# EAGLE design LB_p1_Power-v03(rev2) (EAGLE 6.6.0)
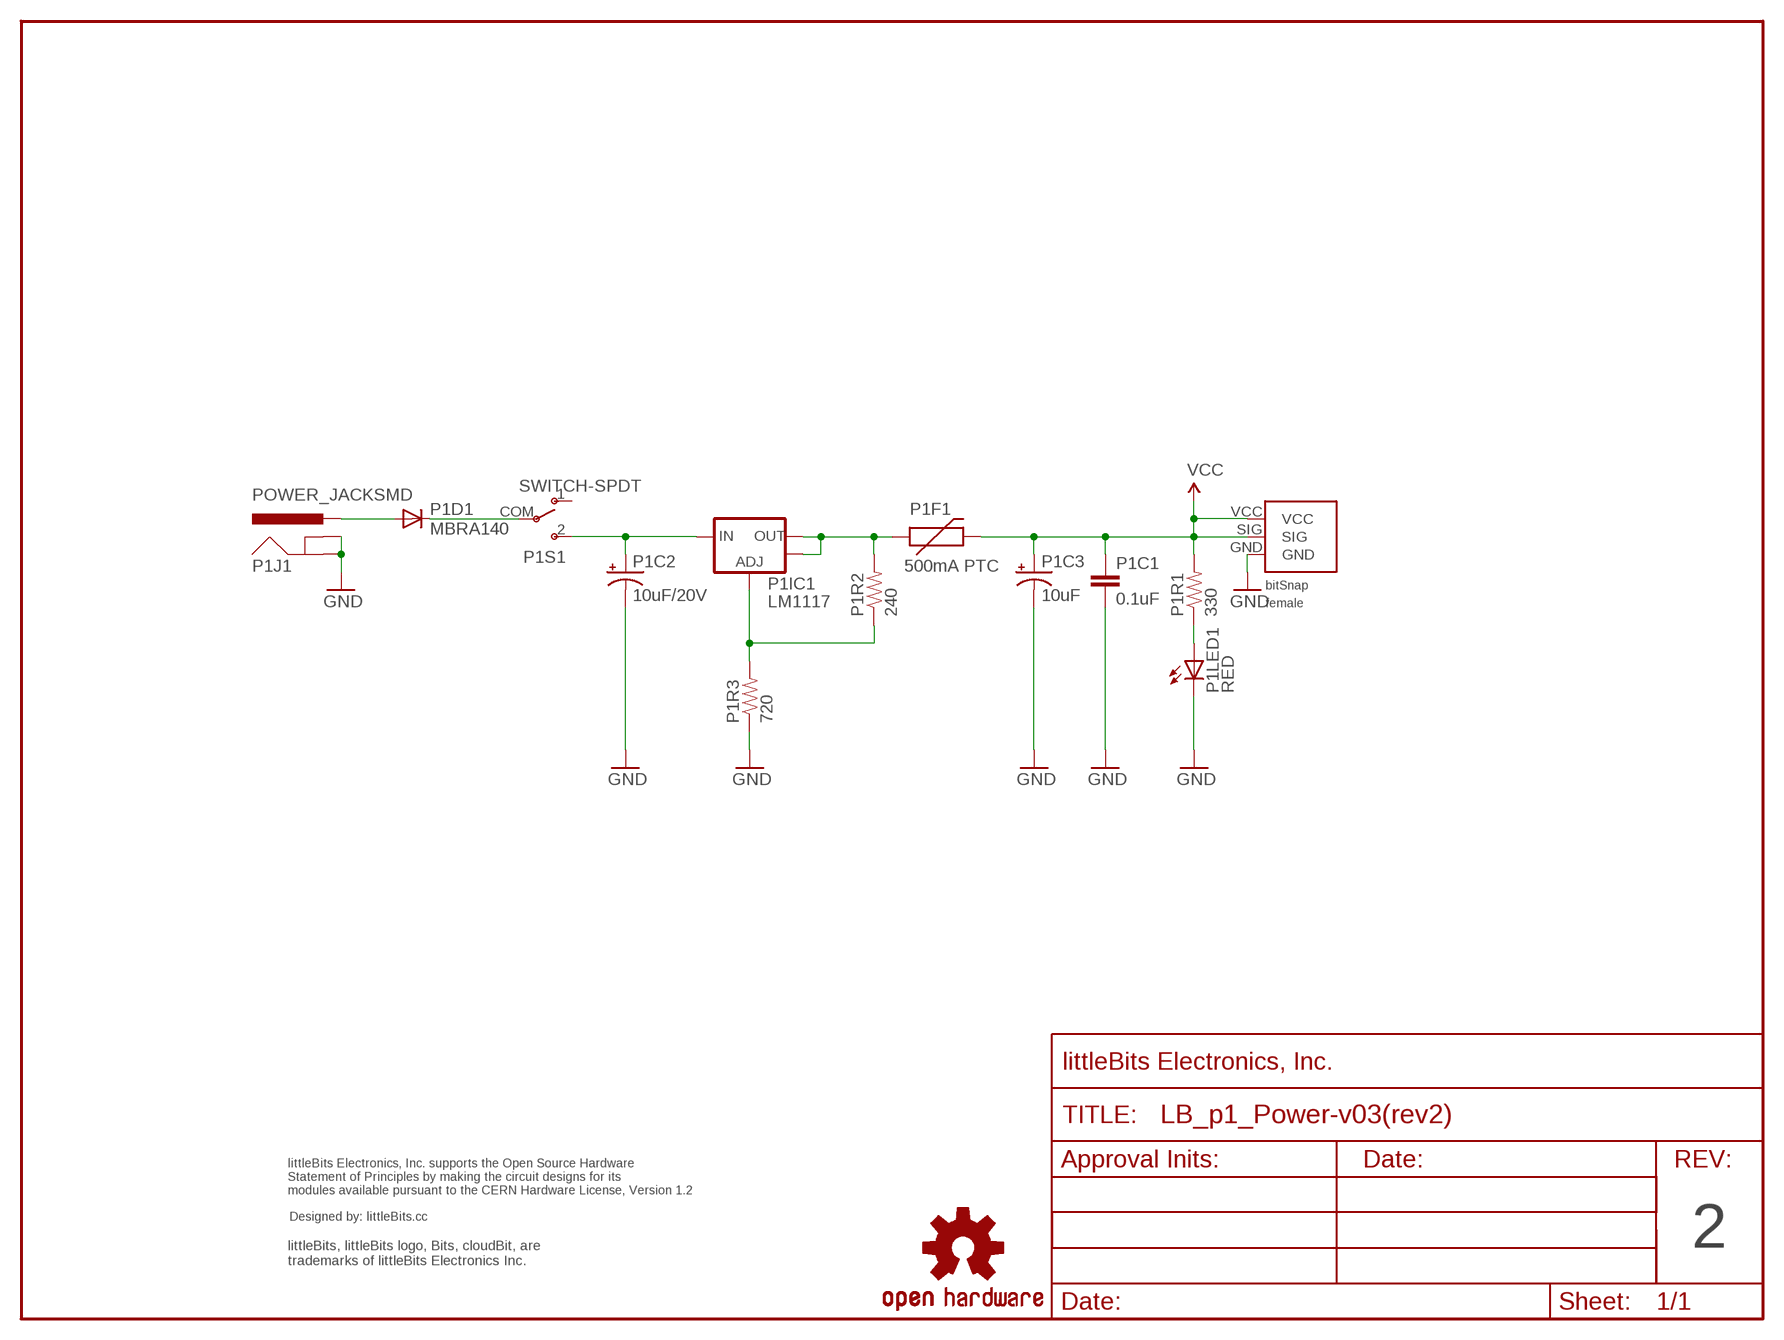
[diagram p0: schematic, sheet 1]

## Parts
P1BSF1  BITSNAP_V03_FEMALE  [BITSNAP_V03_FEMALE]
P1C1  0.1uF  CAP0603-CAP  [0603-CAP]
P1C2  10uF/20V  CAP_POL3528  [EIA3528]
P1C3  10uF  CAP_POL1206  [EIA3216]
P1D1  MBRA140  DIODESMA  [SMA-DIODE]
P1F1  500mA PTC  PTCSMD  [PTC-1206]
P1IC1  LM1117  V_REG_LM1117SOT223  [SOT223]
P1J1  POWER_JACKSMD  [POWER_JACK_SMD]
P1LED1  RED  LED1206  [LED-1206]
P1R1  330  RESISTOR0603-RES  [0603-RES]
P1R2  240  RESISTOR0603-RES  [0603-RES]
P1R3  720  RESISTOR0603-RES  [0603-RES]
P1S1  SWITCH-SPDT  SWITCH-DICGU_SPDT  [LITTLEBITS_SWITCH-DICGU_SPDT]
U$3  OSHW-LOGOL  [OSHW-LOGO-L]
U$4  LB_CREDITS  [OSHWCREDIT]
U$5  FRAME-LETTER-OHWOHW  [FABDWG01-OHW]

## Nets
GND: P1BSF1.GND P1C1.2 P1C2.C(-) P1C3.C(-) P1J1.GND(GNDBREAK) P1J1.P$4(GND) P1LED1.C P1R3.1
N$1: P1D1.C P1S1.COM(P)
N$2: P1F1.1 P1IC1.2(OUT) P1IC1.4(OUT) P1R2.2
N$3: P1IC1.1(ADJ) P1R2.1 P1R3.2
N$4: P1C2.A(+) P1IC1.3(IN) P1S1.2(S)
N$6: P1D1.A P1J1.VIN0(PWR)
N$8: P1LED1.A P1R1.1
VCC: P1BSF1.SIG P1BSF1.VCC P1C1.1 P1C3.A(+) P1F1.2 P1R1.2
Unconnected: P1S1.1(O)

## Notes on the sheet
- 2

## Library data of the parts
P1BSF1 = bitSnap:BITSNAP_V03_FEMALE
P1C1 = SparkFun:CAP: Capacitor Standard 0603 ceramic capacitor, and 0.1" leaded capacitor.
P1C2 P1C3 = SparkFun:CAP_POL: Capacitor Polarized These are standard SMD and PTH capacitors. Normally 10uF, 47uF, and 100uF in electrolytic and tantalum varieties. Always verify the external diameter of the through hole cap, it varies with capacity, voltage, and manufacturer. The EIA devices should be standard.
P1D1 = SparkFun:DIODE: Diode These are standard reverse protection diodes and small signal diodes. SMA package can handle up to about 1A. SOD-323 can handle about 200mA. What the SOD-323 package when ordering, there are some mfgs out there that are 5-pin packages.
P1F1 = SparkFun:PTC: Resettable Fuse PTC Resettable Fuse. Spark Fun Electronics SKU : COM-08357
P1IC1 = SparkFun:V_REG_LM1117: Voltage Regulator LM1117 Standard adjustable voltage regulator but in SMD form. Spark Fun Electronics SKU : COM-00595
P1J1 = SparkFun:POWER_JACK: Power Jack This is the standard 5.5mm barrel jack for power. The PTH is the most common, proven, reliable, footprint. All others are experimental. The Slot footprint only works if the mill layer is transmitted to the PCB fab house so be warned. Spark Fun Electronics SKU : PRT-00119. Mating wall wart : TOL-00298 (and others)
P1LED1 = SparkFun:LED: LEDs Standard schematic elements and footprints for 5mm, 3mm, 1206, and 0603 sized LEDs. 5mm - Spark Fun Electronics SKU : COM-00529 (and others)
P1R1-P1R3 = SparkFun:RESISTOR: Resistor Basic schematic elements and footprints for 0603, 1206, and PTH 1/10th watt (small) resistors.
P1S1 = LITTLEBITS:SWITCH-DICGU_SPDT
U$3 = SparkFun:OSHW-LOGO: Open Source Hardware Logo This logo indicates the piece of hardware it is found on incorporates a OSHW license and/or adheres to the definition of open source hardware found here: http://freedomdefined.org/OSHW
U$4 = LITTLEBITS:LB_CREDITS
U$5 = LITTLEBITS:FRAME-LETTER-OHW

## Board
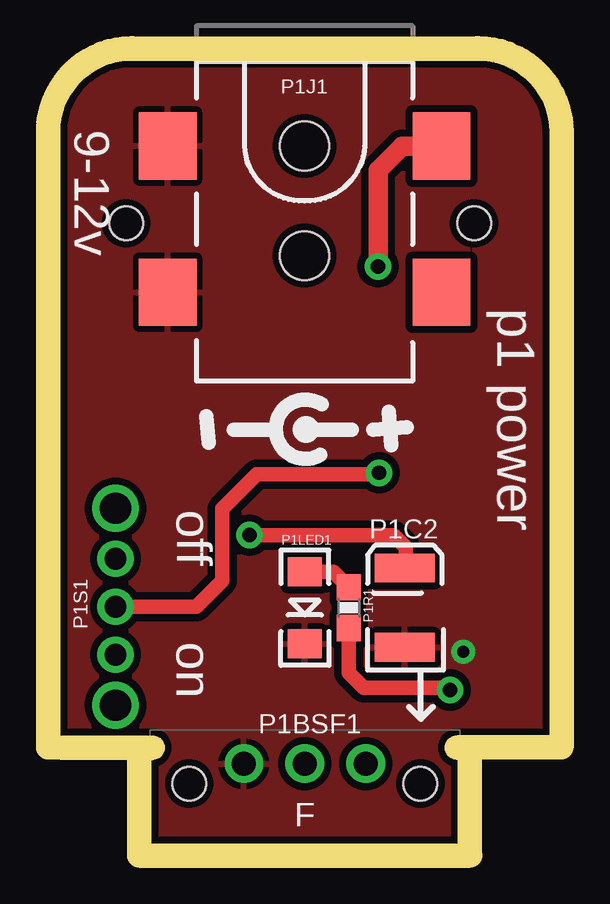
[diagram p1: board, top side]
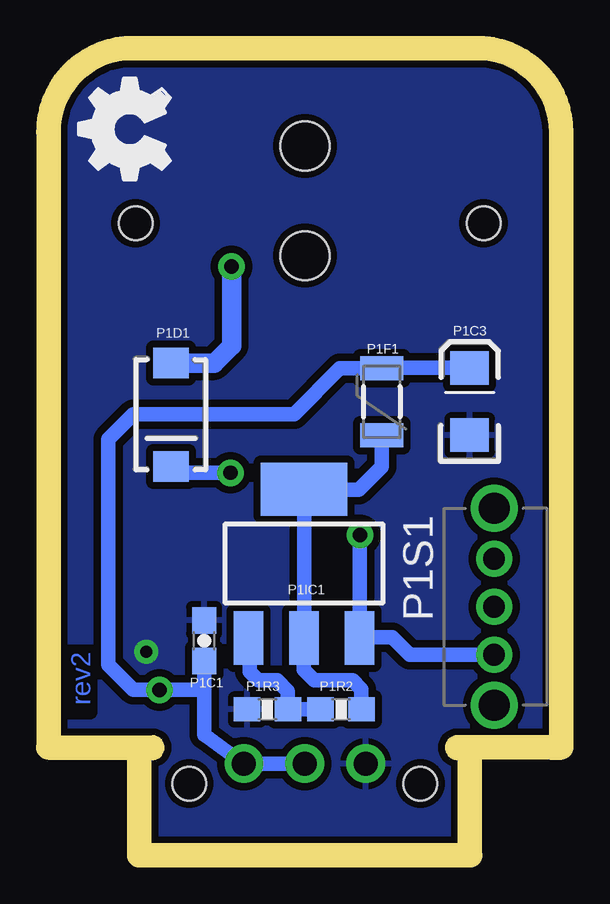
[diagram p2: board, bottom side, seen from below]

Size 20.4 x 32.65 mm. Coordinates in mm from the lower left corner, seen from the top.
Outline: 0,4.5 0,29.65
Outline: 0,29.65 0,29.71
Outline: 20.4,4.5 20.4,29.65 arc90 17.4,32.65 3,32.65 arc90 0,29.65
Copper layers (1*16): Top 0.035mm / dielectric 1.5mm / Bottom 0.035mm
Design rules "default": minimum track width 8mil, minimum drill 20mil, track to track 8mil, track to pad 8mil, pad to pad 8mil, via to via 8mil, smd to smd 8mil, copper to edge 10mil, drill to drill 8mil, minimum pad ring 12mil, minimum via ring 10mil, stop-mask expansion 4mil, vias tented up to drill 25mil, thermal gap 10mil
Milling: 7 lines

### Footprints (pad centres in the part's own frame; a part is rotated, then mirrored left to right if it is on the bottom)
BITSNAP_V03_FEMALE = drill 1: GND 3.91,3.33; SIG 6.45,3.33; VCC 8.99,3.33 | hole 1.4: 1.63,2.5; 11.27,2.5
0603-CAP = smd 1.1 x 1: 1 -0.85,0; 2 0.85,0
EIA3528 = smd 1.2 x 2.5: A 1.65,0; C -1.65,0
EIA3216 = smd 1.4 x 1.6: A 1.4,0; C -1.4,0
SMA-DIODE = smd 1.27 x 1.47: A -2.15,0; C 2.15,0
PTC-1206 = smd 1 x 1.8: 1 -1.4,0; 2 1.4,0
SOT223 = smd 1.219 x 2.235: 1 -2.311,-3.099; 2 0,-3.099; 3 2.311,-3.099 | smd 3.6 x 2.2: 4 0,3.099
POWER_JACK_SMD = smd 2.8 x 2.4: GND 0,-5.7; P$4 6.1,-5.7; VIN0 0,5.7; VIN1 6.1,5.7 | hole 2.032: 0,0; 4.572,0
LED-1206 = smd 1.2 x 1.4: A -1.5,0; C 1.5,0
0603-RES = smd 1.1 x 1: 1 -0.85,0; 2 0.85,0
LITTLEBITS_SWITCH-DICGU_SPDT = drill 0.9: 1 -2,0; 2 2,0; COM 0,0 | drill 1.3: P$4 4.1,0; P$5 -4.1,0
LB_PWR_LEGS = hole 1.4: 2.75,4.4; 17.25,4.4

### Placement (x,y rotation side)
P1BSF1  3.75,0 0 top
P1C1  14.39,8.45 90 bottom
P1C2  14.37,9.83 90 top
P1C3  3.33,18.42 90 bottom
P1D1  15.78,17.87 270 bottom
P1F1  6.99,18.41 90 bottom
P1IC1  10.23,11.67 0 bottom
P1J1  10.19,29.07 270 top
P1LED1  10.2,9.83 270 top
P1R1  12.03,9.83 270 top
P1R2  8.69,5.59 0 bottom
P1R3  11.75,5.59 0 bottom
P1S1  2.31,9.87 270 bottom
U$1  [+/-PWR_JACK]  10.2,15.05 0 top
U$2  [OSHW_FILLX150_NOTEXT]  15.81,26.82 0 top
U$3  -32.77,-67.74 0 top  (outside the outline)
U$4  -93.73,-62.43 0 top  (outside the outline)
U$5  0.2,0.1 0 top
U$12  [LB_PWR_LEGS]  0,21.45 0 top

### Tracks (layer width: path | path; a pad name or v marks a point on that pad's centre or on a via)
GND  (via drill 0.5)
  other vias: 16.8,8
  pour Top (isolate 0.305): 0.15,32.48 20.23,32.48 20.23,0.1 0.15,0.1
  pour Bottom (isolate 0.305): 0.15,32.48 20.23,32.48 20.23,0.1 0.15,0.1
N$1  (via drill 0.6)
  Top 0.61: P1S1.COM 5.67,9.87 6.75,10.95 6.75,13.95 8.2,15.4 13.25,15.4 v13.3,15.45
  Bottom 0.61: v13.3,15.45 15.7,15.45 15.8,15.84 P1D1.C
N$2
  Bottom 0.61: P1R2.2 7.84,6.44 8.2,6.8 9.8,6.8 10.25,7.25 10.25,8.55 P1IC1.2 P1IC1.4 10.21,14.75 7.95,14.75 6.99,15.71 P1F1.1
N$3
  Bottom 0.61: P1R2.1 P1R3.2 10.91,6.36 11.35,6.8 12.15,6.8 12.5,7.15 12.5,8.53 P1IC1.1
N$4  (via drill 0.6)
  Top 0.61: 14.3,11.3 P1C2.A 14.4,11.51 14.4,12.35 13.9,12.85 v7.9,12.85
  Bottom 0.61: P1S1.2 5.82,7.87 6.55,8.6 7.89,8.6 P1IC1.3 7.92,12.17 v7.9,12.85
N$6  (via drill 0.6)
  Top 0.813: v13.25,24.05 13.25,28.05 14.25,29.05 15.87,29.05 P1J1.VIN0
  Bottom 0.813: P1D1.A 13.98,20.02 13.25,20.75 v13.25,24.05
N$8
  Top 0.61: P1LED1.A 11.38,11.33 P1R1.1
VCC  (via drill 0.6)
  Top 0.61: P1R1.2 12.03,7.12 12.65,6.5 16.15,6.5 v16.25,6.4
  Bottom 0.61: P1BSF1.SIG P1BSF1.VCC 14.39,4.54 14.39,6.45 | P1C3.A 6.03,19.82 P1F1.2 8.74,19.81 10.65,17.9 17.35,17.9 18.4,16.85 18.4,7.45 17.35,6.4 v16.25,6.4 14.44,6.4 14.39,6.45 | 14.39,6.45 P1C1.1

### Text on the board
Bottom: rev2
tPlace: 9-12v | p1 power | off | on
tNames: P1J1 | P1S1 | P1BSF1
Milling: 1mm DIA. ROUTER PATH
Reference: LARGE
dxf: 2 | p1 POWER BIT PCB | LB-BIT-p1-POWER-v03-GERBER-rev2 (8-31-2012)